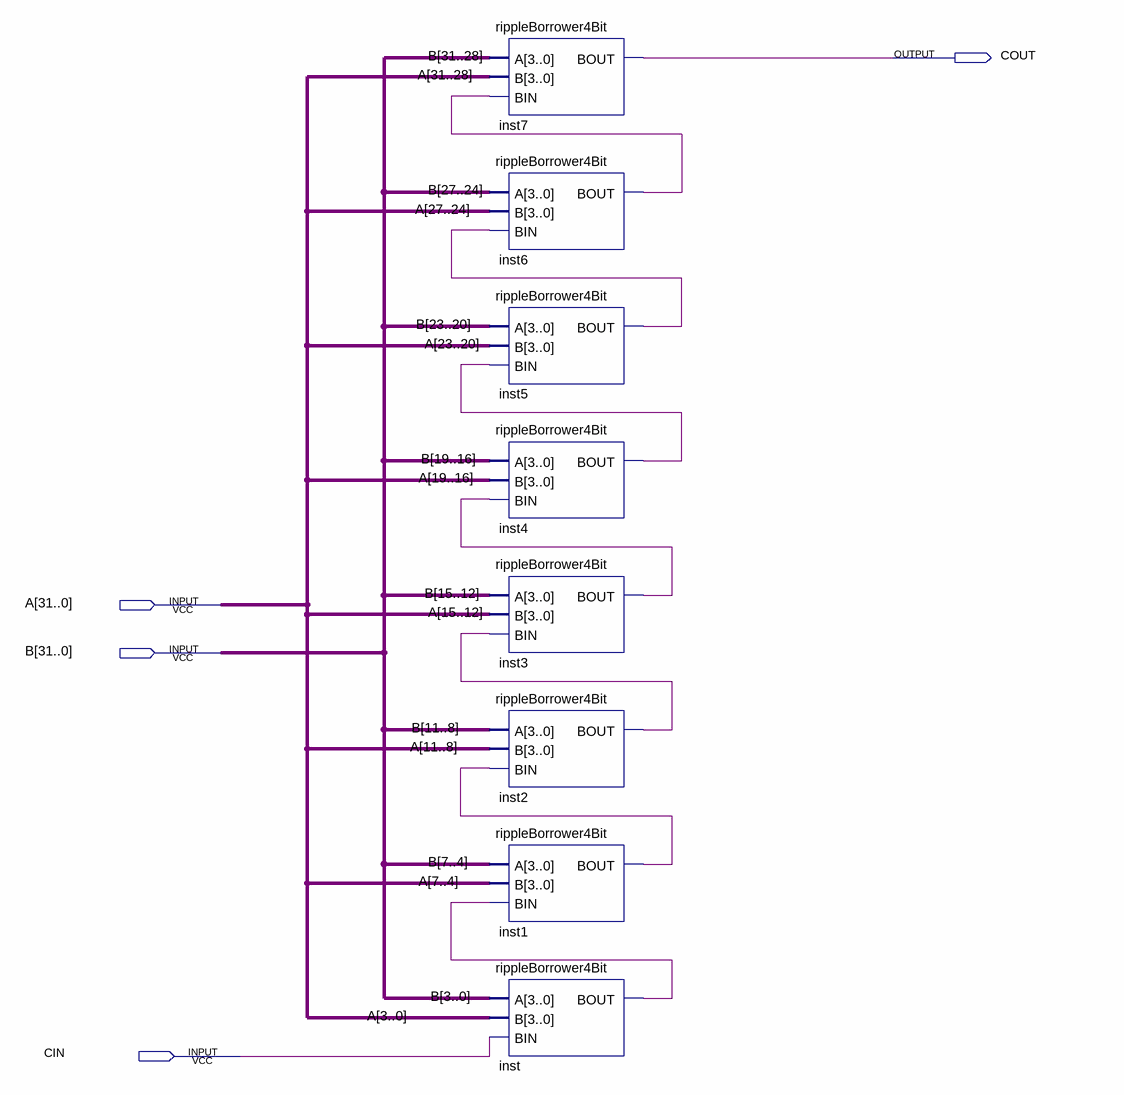
[diagram p0: schematic sheet]
// Quartus schematic rippleBorrower32Bit.bdf as structural Verilog: 8 symbols, 4 pins
module rippleBorrower32Bit (
  input  [31:0] A,
  input  [31:0] B,
  input  CIN,
  output COUT
);

  wire inst1_bout, inst2_bout, inst3_bout, inst4_bout, inst5_bout, inst6_bout, inst_bout;

  rippleBorrower4Bit inst7 (.A(B[31:28]), .B(A[31:28]), .BIN(inst6_bout), .BOUT(COUT));
  rippleBorrower4Bit inst6 (.A(B[27:24]), .B(A[27:24]), .BIN(inst5_bout), .BOUT(inst6_bout));
  rippleBorrower4Bit inst5 (.A(B[23:20]), .B(A[23:20]), .BIN(inst4_bout), .BOUT(inst5_bout));
  rippleBorrower4Bit inst4 (.A(B[19:16]), .B(A[19:16]), .BIN(inst3_bout), .BOUT(inst4_bout));
  rippleBorrower4Bit inst3 (.A(B[15:12]), .B(A[15:12]), .BIN(inst2_bout), .BOUT(inst3_bout));
  rippleBorrower4Bit inst2 (.A(B[11:8]), .B(A[11:8]), .BIN(inst1_bout), .BOUT(inst2_bout));
  rippleBorrower4Bit inst1 (.A(B[7:4]), .B(A[7:4]), .BIN(inst_bout), .BOUT(inst1_bout));
  rippleBorrower4Bit inst (.A(B[3:0]), .B(A[3:0]), .BIN(CIN), .BOUT(inst_bout));
endmodule
